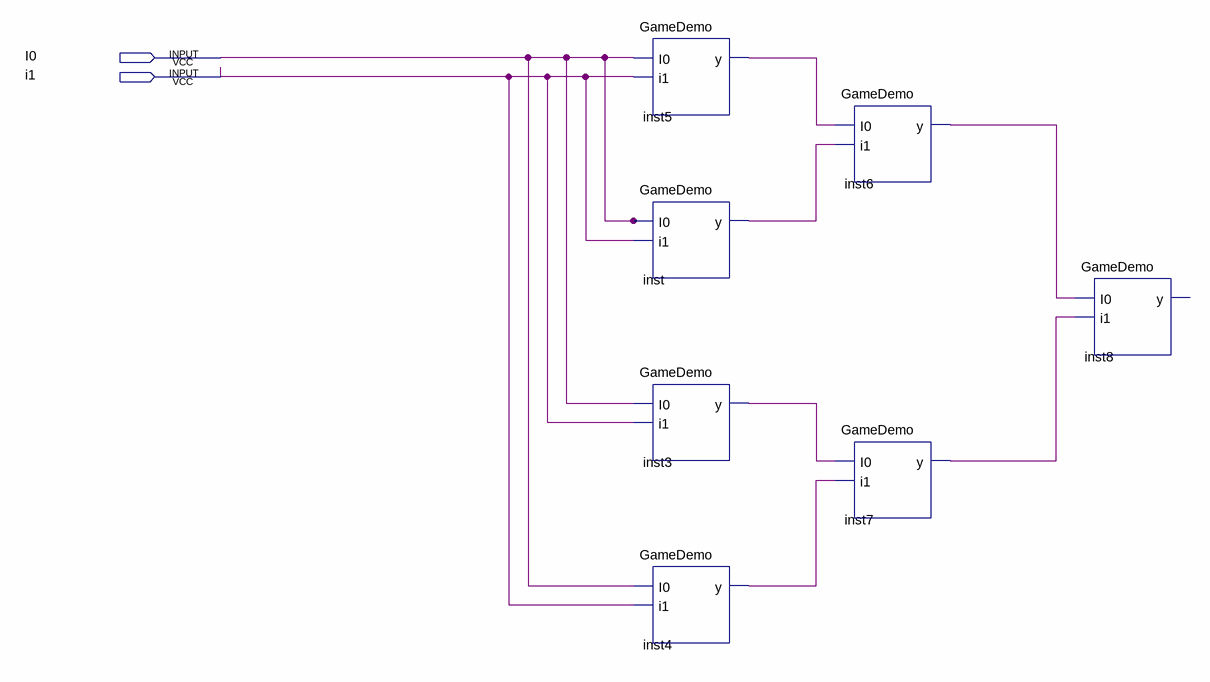
[diagram p0: schematic sheet]
// Quartus schematic Block2.bdf as structural Verilog: 7 symbols, 2 pins
module Block2 (
  input  I0,
  input  i1
);

  wire inst3_y, inst4_y, inst5_y, inst6_y, inst7_y, inst_y;

  GameDemo inst5 (.I0(I0), .i1(i1), .y(inst5_y));
  GameDemo inst (.I0(I0), .i1(i1), .y(inst_y));
  GameDemo inst3 (.I0(I0), .i1(i1), .y(inst3_y));
  GameDemo inst4 (.I0(I0), .i1(i1), .y(inst4_y));
  GameDemo inst6 (.I0(inst5_y), .i1(inst_y), .y(inst6_y));
  GameDemo inst7 (.I0(inst3_y), .i1(inst4_y), .y(inst7_y));
  GameDemo inst8 (.I0(inst6_y), .i1(inst7_y));  // open: y
endmodule
